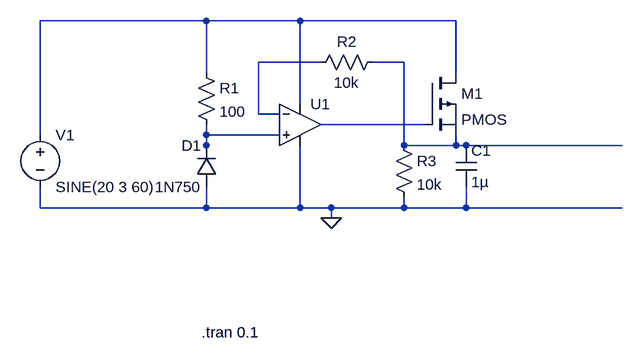
[diagram p0: schematic op_amp_mosfet_linear_regulator.asc]
op_amp_mosfet_linear_regulator.asc, the LTspice schematic file:
Version 4.1
SHEET 1 880 680
WIRE 64 -64 -192 -64
WIRE 208 -64 64 -64
WIRE 448 -64 208 -64
WIRE 240 0 144 0
WIRE 368 0 320 0
WIRE 64 16 64 -64
WIRE 448 16 448 -64
WIRE 208 64 208 -64
WIRE 144 80 144 0
WIRE 176 80 144 80
WIRE 400 96 240 96
WIRE -192 112 -192 -64
WIRE 64 112 64 96
WIRE 176 112 64 112
WIRE 64 128 64 112
WIRE 368 128 368 0
WIRE 448 128 448 112
WIRE 448 128 368 128
WIRE 464 128 448 128
WIRE 704 128 464 128
WIRE 64 144 64 128
WIRE -192 224 -192 192
WIRE 64 224 64 192
WIRE 64 224 -192 224
WIRE 208 224 208 128
WIRE 208 224 64 224
WIRE 256 224 208 224
WIRE 368 224 368 208
WIRE 368 224 256 224
WIRE 464 224 464 192
WIRE 464 224 368 224
WIRE 704 224 464 224
WIRE 256 240 256 224
FLAG 256 240 0
SYMBOL voltage -192 96 R0
WINDOW 123 0 0 Left 0
WINDOW 39 0 0 Left 0
SYMATTR InstName V1
SYMATTR Value SINE(20 3 60)
SYMBOL OpAmps\\UniversalOpAmp2 208 96 R0
SYMATTR InstName U1
SYMBOL diode 80 192 R180
WINDOW 0 24 64 Left 2
WINDOW 3 24 0 Left 2
SYMATTR InstName D1
SYMATTR Value 1N750
SYMATTR Description Diode
SYMATTR Type diode
SYMBOL res 48 0 R0
SYMATTR InstName R1
SYMATTR Value 100
SYMBOL res 336 -16 R90
WINDOW 0 0 56 VBottom 2
WINDOW 3 32 56 VTop 2
SYMATTR InstName R2
SYMATTR Value 10k
SYMBOL cap 448 128 R0
SYMATTR InstName C1
SYMATTR Value 1µ
SYMBOL res 352 112 R0
SYMATTR InstName R3
SYMATTR Value 10k
SYMBOL pmos 400 16 R0
SYMATTR InstName M1
TEXT 56 416 Left 2 !.tran 0.1

The netlist it stands for:
* op_amp_mosfet_linear_regulator.asc
V1 N001 0 SINE(20 3 60)
X§U1 N005 N002 N001 0 N004 level2 Avol=1Meg GBW=10Meg Slew=10Meg Ilimit=25m Rail=0 Vos=0 En=0 Enk=0 In=0 Ink=0 Rin=500Meg  ; pins In+ In- V+ V- OUT
D1 0 N005 1N750
R1 N001 N005 100
R2 N003 N002 10k
C1 N003 0 1µ
R3 N003 0 10k
M1 N001 N004 N003 N003 PMOS
.model D D
.lib standard.dio
.model NMOS NMOS
.model PMOS PMOS
.lib standard.mos
.tran 0.1
.lib UniversalOpAmp2.lib
.backanno
.end